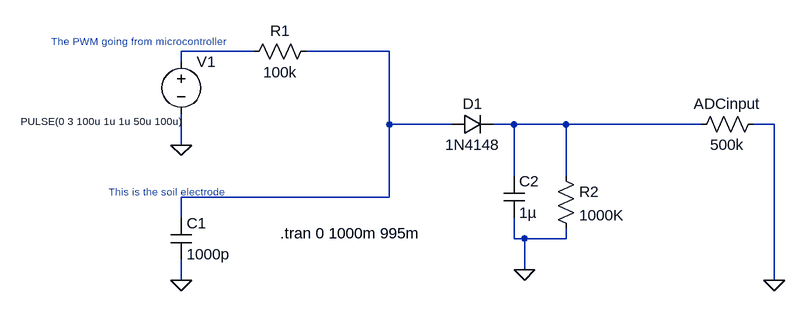
[diagram p0: schematic Soil Moisture sensor simulation.asc]
Soil Moisture sensor simulation.asc, the LTspice schematic file:
Version 4
SHEET 1 964 680
WIRE 144 144 32 144
WIRE 352 144 224 144
WIRE 32 160 32 144
WIRE 352 256 352 144
WIRE 448 256 352 256
WIRE 544 256 512 256
WIRE 624 256 544 256
WIRE 832 256 624 256
WIRE 944 256 912 256
WIRE 32 288 32 240
WIRE 544 336 544 256
WIRE 624 336 624 256
WIRE 352 368 352 256
WIRE 352 368 32 368
WIRE 32 400 32 368
WIRE 544 432 544 400
WIRE 560 432 544 432
WIRE 624 432 624 416
WIRE 624 432 560 432
WIRE 560 480 560 432
WIRE 32 496 32 464
WIRE 944 496 944 256
FLAG 32 288 0
FLAG 32 496 0
FLAG 560 480 0
FLAG 944 496 0
SYMBOL res 240 128 R90
WINDOW 0 0 56 VBottom 2
WINDOW 3 32 56 VTop 2
SYMATTR InstName R1
SYMATTR Value 100k
SYMBOL voltage 32 144 R0
WINDOW 3 -247 107 Left 1
WINDOW 123 0 0 Left 0
WINDOW 39 0 0 Left 0
SYMATTR InstName V1
SYMATTR Value PULSE(0 3 100u 1u 1u 50u 100u)
SYMBOL cap 16 400 R0
SYMATTR InstName C1
SYMATTR Value 1000p
SYMBOL diode 448 272 R270
WINDOW 0 32 32 VTop 2
WINDOW 3 0 32 VBottom 2
SYMATTR InstName D1
SYMATTR Value 1N4148
SYMBOL cap 528 336 R0
SYMATTR InstName C2
SYMATTR Value 1µ
SYMBOL res 608 320 R0
SYMATTR InstName R2
SYMATTR Value 1000K
SYMBOL res 928 240 R90
WINDOW 0 0 56 VBottom 2
WINDOW 3 32 56 VTop 2
SYMATTR InstName ADCinput
SYMATTR Value 500k
TEXT -80 360 Left 1 ;This is the soil electrode
TEXT -168 128 Left 1 ;The PWM going from microcontroller
TEXT 184 424 Left 2 !.tran 0 1000m 995m

The netlist it stands for:
* Soil Moisture sensor simulation.asc
R1 N002 N001 100k
V1 N001 0 PULSE(0 3 100u 1u 1u 50u 100u)
C1 N002 0 1000p
D1 N002 N003 1N4148
C2 N003 0 1µ
R2 N003 0 1000K
R§ADCinput 0 N003 500k
.model D D
.lib standard.dio
* This is the soil electrode
* The PWM going from microcontroller
.tran 0 1000m 995m
.backanno
.end